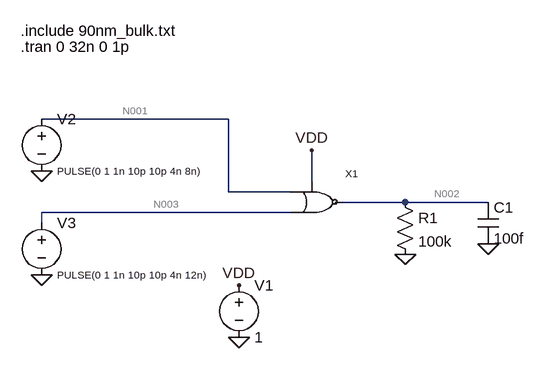
[diagram p0: schematic nor_test.asc]
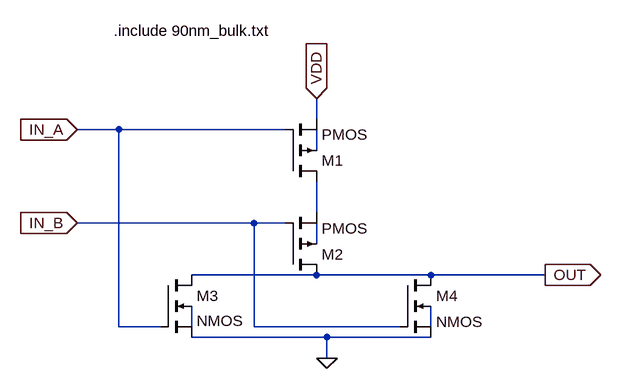
[diagram p1: sub-circuit nor.asc]
nor_test.asc, the LTspice schematic file:
Version 4
SHEET 1 880 680
WIRE 64 32 -224 32
WIRE 192 128 192 80
WIRE 64 144 64 32
WIRE 160 144 64 144
WIRE 336 160 240 160
WIRE 464 160 336 160
WIRE 160 176 -224 176
WIRE -224 192 -224 176
FLAG 80 368 0
FLAG 80 288 VDD
FLAG 192 80 VDD
FLAG -224 112 0
FLAG -224 272 0
FLAG 336 240 0
FLAG 464 224 0
SYMBOL nor 192 160 R0
SYMATTR InstName X1
SYMBOL voltage 80 272 R0
WINDOW 123 0 0 Left 0
WINDOW 39 0 0 Left 0
SYMATTR InstName V1
SYMATTR Value 1
SYMBOL voltage -224 16 R0
WINDOW 3 24 96 Left 1
WINDOW 123 0 0 Left 0
WINDOW 39 0 0 Left 0
SYMATTR InstName V2
SYMATTR Value PULSE(0 1 1n 10p 10p 4n 8n)
SYMBOL voltage -224 176 R0
WINDOW 3 24 96 Left 1
WINDOW 123 0 0 Left 0
WINDOW 39 0 0 Left 0
SYMATTR InstName V3
SYMATTR Value PULSE(0 1 1n 10p 10p 4n 12n)
SYMBOL res 320 144 R0
SYMATTR InstName R1
SYMATTR Value 100k
SYMBOL cap 448 160 R0
SYMATTR InstName C1
SYMATTR Value 100f
TEXT -256 -104 Left 2 !.include 90nm_bulk.txt
TEXT -256 -80 Left 2 !.tran 0 32n 0 1p

nor.asc, the sub-circuit schematic file:
Version 4
SHEET 1 880 680
WIRE 144 80 144 48
WIRE -160 96 -224 96
WIRE 96 96 -160 96
WIRE 144 128 144 96
WIRE 144 224 144 176
WIRE 48 240 -224 240
WIRE 96 240 48 240
WIRE 144 272 144 240
WIRE 144 320 -48 320
WIRE 320 320 144 320
WIRE 496 320 320 320
WIRE -160 400 -160 96
WIRE -96 400 -160 400
WIRE -48 400 -48 368
WIRE 48 400 48 240
WIRE 272 400 48 400
WIRE 320 400 320 368
WIRE 160 416 -48 416
WIRE 320 416 160 416
WIRE 160 448 160 416
FLAG 160 448 0
FLAG -224 96 IN_A
IOPIN -224 96 In
FLAG -224 240 IN_B
IOPIN -224 240 In
FLAG 144 48 VDD
IOPIN 144 48 In
FLAG 496 320 OUT
IOPIN 496 320 Out
SYMBOL pmos4 96 176 M180
SYMATTR InstName M1
SYMATTR Value2 l=90n w=400n
SYMBOL pmos4 96 320 M180
SYMATTR InstName M2
SYMATTR Value2 l=90n w=400n
SYMBOL nmos4 -96 320 R0
WINDOW 3 56 71 Left 2
SYMATTR InstName M3
SYMATTR Value2 l=90n w=200n
SYMBOL nmos4 272 320 R0
SYMATTR InstName M4
SYMATTR Value2 l=90n w=200n
TEXT -168 -56 Left 2 !.include 90nm_bulk.txt

The netlist it stands for:
* nor_test.asc
XX1 N001 N003 N002 VDD nor
V1 VDD 0 1
V2 N001 0 PULSE(0 1 1n 10p 10p 4n 8n)
V3 N003 0 PULSE(0 1 1n 10p 10p 4n 12n)
R1 N002 0 100k
C1 N002 0 100f

* block symbol definitions
.subckt nor IN_A IN_B OUT VDD
M1 N002 IN_A VDD N001 PMOS l=90n w=400n
M2 OUT IN_B N002 N003 PMOS l=90n w=400n
M3 OUT IN_A 0 N004 NMOS l=90n w=200n
M4 OUT IN_B 0 N005 NMOS l=90n w=200n
.include 90nm_bulk.txt
.ends nor

.model NMOS NMOS
.model PMOS PMOS
.lib standard.mos
.include 90nm_bulk.txt
.tran 0 32n 0 1p
.backanno
.end

* Results of the author's LTspice run, read from the files saved beside the schematic
* Operating Point, zero values left out:
*   V(vdd) = 1 V
*   V(n002) = 948.2 mV
*   I(R1) = 9.482 µA
*   I(V1) = -9.531 µA
*   I(V2) = 95.04 pA
*   I(V3) = 94.7 pA
*   Ix(x1:IN_A) = -95.04 pA
*   Ix(x1:IN_B) = -94.7 pA
*   Ix(x1:OUT) = -9.482 µA
*   Ix(x1:VDD) = 9.531 µA
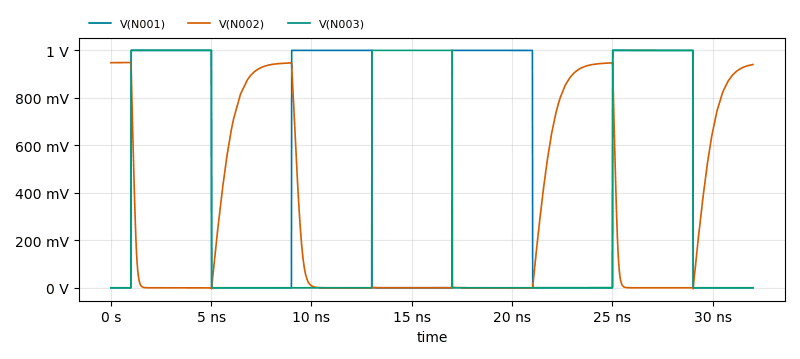
[diagram p2: Transient Analysis of nor_test.asc, plotted from the saved traces]
* Transient Analysis, 1 run:
*   V(N001): min 0 V, max 1 V, average 501.2 mV, rms 707.7 mV, last 0 V
*   V(N002): min -4.251 mV, max 950.4 mV, average 303.8 mV, rms 502.9 mV, last 940.3 mV
*   V(N003): min 0 V, max 1 V, average 375.9 mV, rms 612.9 mV, last 0 V